# Altium project control.PrjPCB
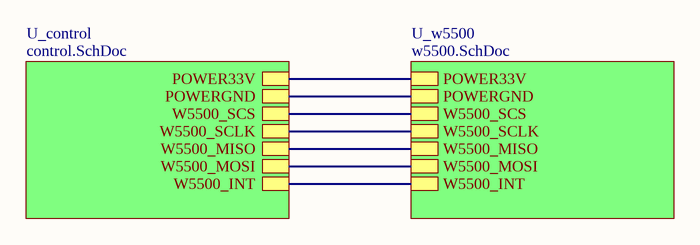
[diagram p0: main.SchDoc]
3 sheets, 91 parts. Net scope: hierarchical (ports join the sheet entries above them; power ports are global).
Board file: control.PcbDoc
Sheets:
  main.SchDoc
    U_control = control.SchDoc
    U_w5500 = w5500.SchDoc

## Sheet main.SchDoc
size A4

### Sub-sheets
U_control = control.SchDoc: POWER33V, POWERGND, W5500_INT, W5500_SCS, W5500_SCLK, W5500_MISO, W5500_MOSI
U_w5500 = w5500.SchDoc: POWERGND, POWER33V, W5500_SCS, W5500_SCLK, W5500_MISO, W5500_MOSI, W5500_INT

### Nets
GND: sheet U_control/POWERGND, sheet U_w5500/POWERGND
VCC33V: sheet U_control/POWER33V, sheet U_w5500/POWER33V
INT: sheet U_control/W5500_INT, sheet U_w5500/W5500_INT
MISO: sheet U_control/W5500_MISO, sheet U_w5500/W5500_MISO
MOSI: sheet U_control/W5500_MOSI, sheet U_w5500/W5500_MOSI
SCLK: sheet U_control/W5500_SCLK, sheet U_w5500/W5500_SCLK
SCS: sheet U_control/W5500_SCS, sheet U_w5500/W5500_SCS

## Sheet control.SchDoc
size A4
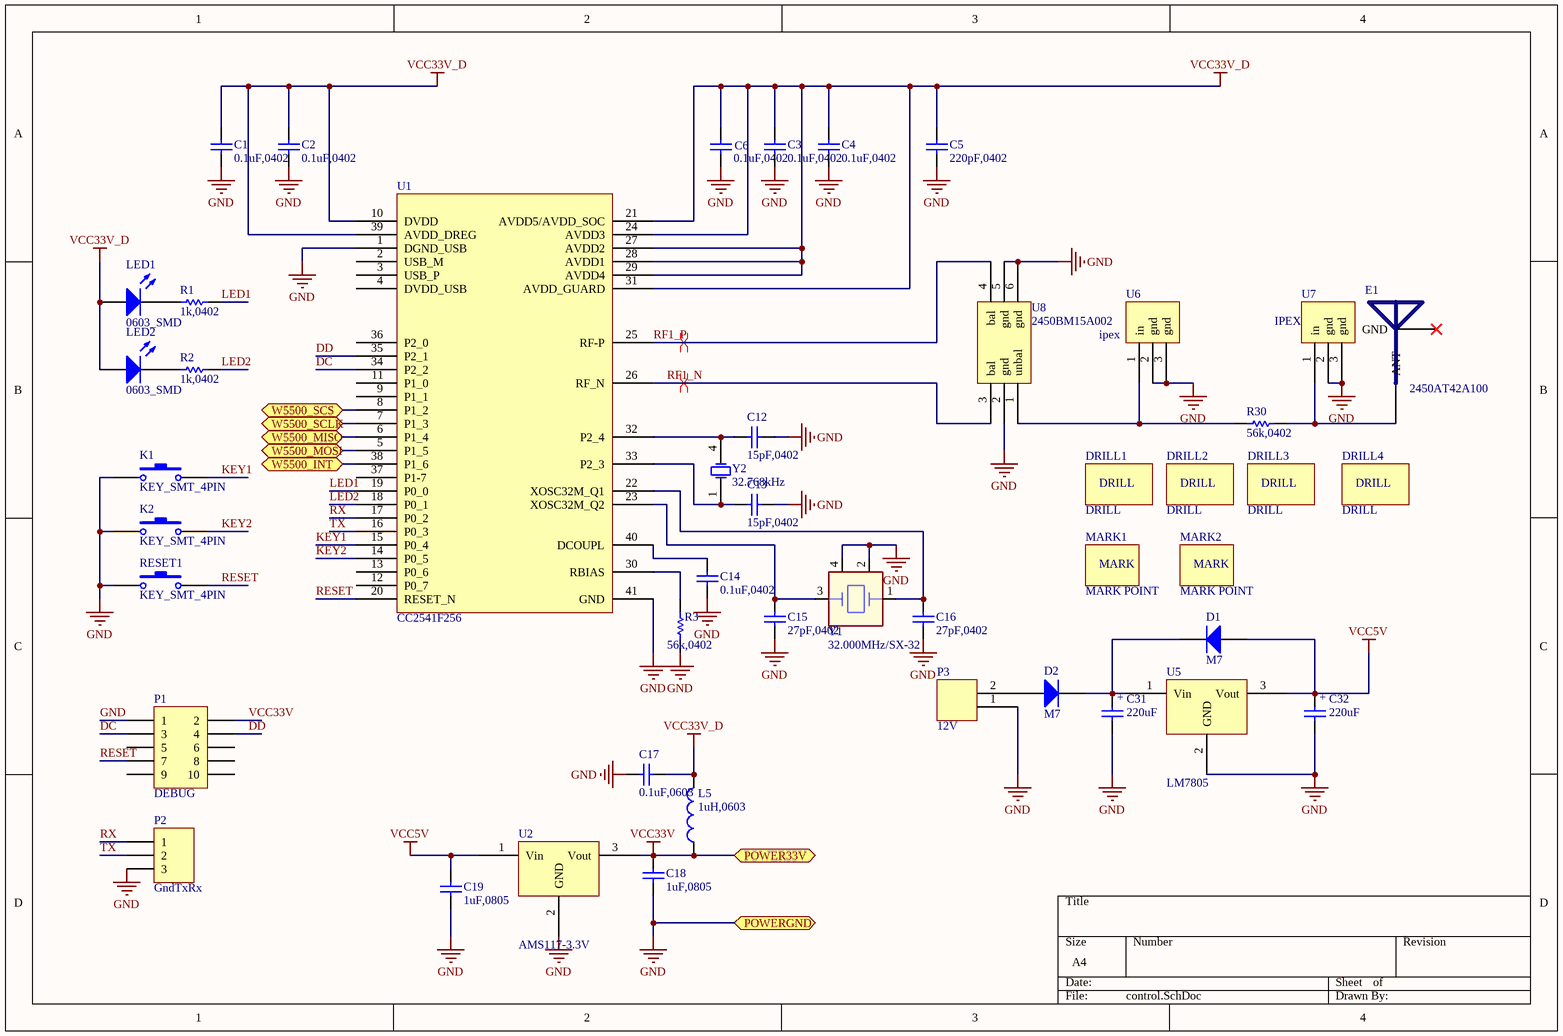
[diagram p1: control.SchDoc]

### Parts
C1  0.1uF,0402  [C0402]
C2  0.1uF,0402  [C0402]
C3  0.1uF,0402  [C0402]
C4  0.1uF,0402  [C0402]
C5  220pF,0402  [C0402]
C6  0.1uF,0402  [C0402]
C12  15pF,0402  [C0402]
C13  15pF,0402  [C0402]
C14  0.1uF,0402  [C0402]
C15  27pF,0402  [C0402]
C16  27pF,0402  [C0402]
C17  0.1uF,0603  [C0603]
C18  1uF,0805  [C0805]
C19  1uF,0805  [C0805]
C31  220uF  [CDIP2]
C32  220uF  [CDIP2]
D1  M7  [DO214AC]
D2  M7  [DO214AC]
DRILL1  DRILL  [DRILL_3MM]
DRILL2  DRILL  [DRILL_3MM]
DRILL3  DRILL  [DRILL_3MM]
DRILL4  DRILL  [DRILL_3MM]
E1  2450AT42A100  [BT_ANT_PCB]
K1  KEY_SMT_4PIN  [KEY-SMT]
K2  KEY_SMT_4PIN  [KEY-SMT]
L5  1uH,0603  [L0603]
LED1  0603_SMD  [LED0603]
LED2  0603_SMD  [LED0603]
MARK1  MARK POINT  [MARK_POINT]
MARK2  MARK POINT  [MARK_POINT]
P1  DEBUG  [HDR2X5]
P2  GndTxRx  [HDR1X3]
P3  12V  [2EDG-5.08-2P]
R1  1k,0402  [R0402]
R2  1k,0402  [R0402]
R3  56k,0402  [R0402]
R30  56k,0402  [R0805]
RESET1  KEY_SMT_4PIN  [KEY-SMT]
U1  CC2541F256  [PQFP40]
U2  AMS117-3.3V  [SOT223]
U5  LM7805  [SOT252]
U6  ipex  [IPEX]
U7  IPEX  [IPEX]
U8  2450BM15A002  [2450BM15A002]
Y1  32.000MHz/SX-32  [3225]
Y2  32.768kHz  [1206]

### Ports
POWER33V, POWERGND, W5500_INT, W5500_MISO, W5500_MOSI, W5500_SCLK, W5500_SCS

### Nets
GND: C1.1 C2.1 C3.1 C4.1 C5.1 C6.2 C12.1 C13.1 C14.1 C15.1 C16.1 C17.2 C18.1 C19.1 C31.2 C32.2 K1.1 K2.1 P1.1 P2.3 P3.1 R3.1 RESET1.1 U1.1(DGND_USB) U1.41(GND) U2.2(GND) U5.2(GND) U6.2(gnd) U6.3(gnd) U7.2(gnd) U7.3(gnd) U8.2(gnd) U8.5(gnd) U8.6(gnd) Y1.2 Y1.4 ; port POWERGND
VCC5V: C19.2 C32.1 D1.1(A) U2.1(Vin) U5.3(Vout)
VCC33V: C18.2 L5.1 P1.2 U2.3(Vout) ; port POWER33V
VCC33V_D: C1.2 C2.2 C3.2 C4.2 C5.2 C6.1 C17.1 L5.2 LED1.1(A) LED2.1(A) U1.10(DVDD) U1.21(AVDD5/AVDD_SOC) U1.24(AVDD3) U1.27(AVDD2) U1.28(AVDD1) U1.29(AVDD4) U1.31(AVDD_GUARD) U1.39(AVDD_DREG)
DC: P1.3 U1.34(P2_2)
DD: P1.4 U1.35(P2_1)
INT: U1.38(P1_6) ; port W5500_INT
KEY1: K1.2 U1.15(P0_4)
KEY2: K2.2 U1.14(P0_5)
LED1: R1.2 U1.19(P0_0)
LED2: R2.2 U1.18(P0_1)
MISO: U1.6(P1_4) ; port W5500_MISO
MOSI: U1.5(P1_5) ; port W5500_MOSI
RESET: P1.7 RESET1.2 U1.20(RESET_N)
RF1_N: U1.26(RF_N) U8.3(bal)
RF1_P: U1.25(RF-P) U8.4(bal)
RX: P2.1 U1.17(P0_2)
SCLK: U1.7(P1_3) ; port W5500_SCLK
SCS: U1.8(P1_2) ; port W5500_SCS
TX: P2.2 U1.16(P0_3)
NetC12_2: C12.2 U1.32(P2_4) Y2.4(OSC2)
NetC13_2: C13.2 U1.33(P2_3) Y2.1(OSC1)
NetC14_2: C14.2 U1.40(DCOUPL)
NetC15_2: C15.2 U1.23(XOSC32M_Q2) Y1.3
NetC16_2: C16.2 U1.22(XOSC32M_Q1) Y1.1
NetC31_1: C31.1 D1.2(K) D2.2(K) U5.1(Vin)
NetD2_1: D2.1(A) P3.2
NetE1_1: E1.1(ANT) R30.2 U7.1(in)
NetLED1_2: LED1.2(K) R1.1
NetLED2_2: LED2.2(K) R2.1
NetR3_2: R3.2 U1.30(RBIAS)
NetR30_1: R30.1 U6.1(in) U8.1(unbal)

Not connected (* = marked no-connect by the designer): E1 2(GND)*; P1 5 6 8 9 10; U1 2(USB_M) 3(USB_P) 4(DVDD_USB) 9(P1_1) 11(P1_0) 12(P0_7) 13(P0_6) 36(P2_0) 37(P1-7)

### Layout directives
differential pair: RF1_N, RF1_P

### Notes on the sheet
- (in symbol E_CAP) +
- (in symbol MARK_POINT) MARK

### Library data of the parts
C1-C6 C12-C19 = CAP: Capacitor; Published: 8-Jun-2000; Revision: July-2002: Re-released for DXP Platform.; Publisher: Altium Limited
  C1-C4 C6 C14 C17: Value: 0.1uF
  C5: Value: 220pF
  C12 C13: Value: 15pF
  C15 C16: Value: 27pF
  C18: value: 1uF
  C19: Value: 1uF
C31 C32 = E_CAP: electric capacitor; value: 220uF
D1 D2 = DIODE: value: M7
E1 = BT_ANT_PCB
K1 K2 RESET1 = KEY
L5 = Inductor: Code_IEC: 1005; Published: 8-Jun-2000; LatestRevisionDate: 17-Jul-2002; LatestRevisionNote: Re-released for DXP Platform.; PackageReference: 0402-A; Publisher: Altium Limited; Code_JEITA: 0402; Value: 1uH
LED1 LED2 = LED
MARK1 MARK2 = MARK_POINT
P1 = Header 5X2: Header, 5-Pin, Dual row; LatestRevisionDate: 17-Jul-2002; LatestRevisionNote: Re-released for DXP Platform.; Publisher: Altium Limited
P2 = Header 3: Header, 3-Pin; LatestRevisionDate: 17-Jul-2002; LatestRevisionNote: Re-released for DXP Platform.; Publisher: Altium Limited
P3 = 2EDG-5.08-2P
R1-R3 = Res1: Resistor; Published: 8-Jun-2000; Revision: July-2002: Re-released for DXP Platform.; Publisher: Altium Limited
  R1 R2: value: 1k
  R3: value: 56k
R30 = Res1: Resistor; value: 10k; Published: 8-Jun-2000; Revision: July-2002: Re-released for DXP Platform.; Publisher: Altium Limited
U1 = CC254x: TI cc2541F256; value: cc2541F256
U2 = VOLT_REG: voltage regulator tube; pin to pad: 1>3 2>1 3>2; value: ams1117-3.3V
U5 = VOLT_REG: voltage regulator tube; value: LM7805
Y1 = CRYSTAL_5: SPXO; value: 32MHz
Y2 = DA740C: crystal; pin to pad: 4>2; value: 32.768kHz

## Sheet w5500.SchDoc
size A4
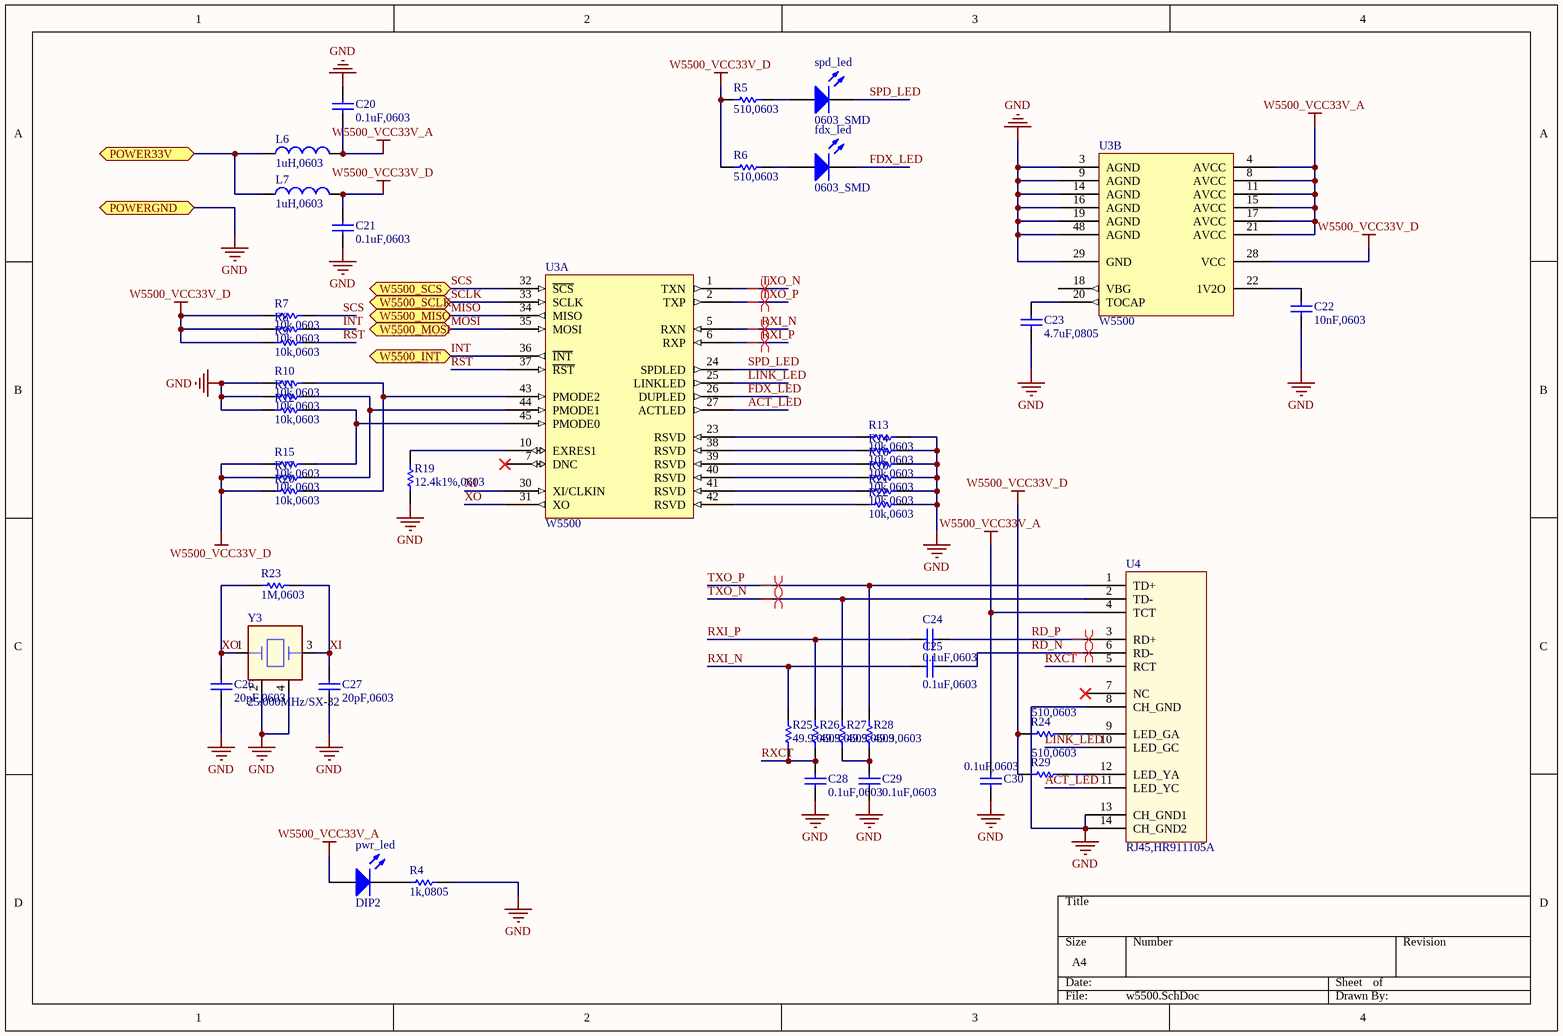
[diagram p2: w5500.SchDoc]

### Parts
C20  0.1uF,0603  [C0603]
C21  0.1uF,0603  [C0603]
C22  10nF,0603  [C0603]
C23  4.7uF,0805  [C0805]
C24  0.1uF,0603  [C0603]
C25  0.1uF,0603  [C0603]
C26  20pF,0603  [C0603]
C27  20pF,0603  [C0603]
C28  0.1uF,0603  [C0603]
C29  0.1uF,0603  [C0603]
C30  0.1uF,0603  [C0603]
fdx_led  0603_SMD  [LED0805]
L6  1uH,0603  [L0603]
L7  1uH,0603  [L0603]
pwr_led  DIP2  [LEDDIP2]
R4  1k,0805  [R0805]
R5  510,0603  [R0603]
R6  510,0603  [R0603]
R7  10k,0603  [R0603]
R8  10k,0603  [R0603]
R9  10k,0603  [R0603]
R10  10k,0603  [R0603]
R11  10k,0603  [R0603]
R12  10k,0603  [R0603]
R13  10k,0603  [R0603]
R14  10k,0603  [R0603]
R15  10k,0603  [R0603]
R16  10k,0603  [R0603]
R17  10k,0603  [R0603]
R18  10k,0603  [R0603]
R19  12.4k1%,0603  [R0603]
R20  10k,0603  [R0603]
R21  10k,0603  [R0603]
R22  10k,0603  [R0603]
R23  1M,0603  [R0603]
R24  510,0603  [R0603]
R25  49.9,0603  [R0603]
R26  49.9,0603  [R0603]
R27  49.9,0603  [R0603]
R28  49.9,0603  [R0603]
R29  510,0603  [R0603]
spd_led  0603_SMD  [LED0805]
U3  W5500  [LQFP48]  (parts A,B of 2)
U4  RJ45,HR911105A  [RJ45]
Y3  25.000MHz/SX-32  [3225]

### Ports
POWER33V, POWERGND, W5500_INT, W5500_MISO, W5500_MOSI, W5500_SCLK, W5500_SCS

### Nets
GND: C20.2 C21.1 C22.1 C23.1 C26.2 C27.2 C28.1 C29.2 C30.1 R4.2 R10.1 R11.1 R12.1 R13.2 R14.2 R16.2 R18.2 R19.1 R21.2 R22.2 U3.3(AGND) U3.9(AGND) U3.14(AGND) U3.16(AGND) U3.19(AGND) U3.29(GND) U3.48(AGND) U4.8(CH_GND) U4.13(CH_GND1) U4.14(CH_GND2) Y3.2 Y3.4 ; port POWERGND
VCC33V: L6.1 L7.1 ; port POWER33V
W5500_VCC33V_A: C20.1 C30.2 L6.2 pwr_led.1(A) U3.4(AVCC) U3.8(AVCC) U3.11(AVCC) U3.15(AVCC) U3.17(AVCC) U3.21(AVCC) U4.4(TCT)
W5500_VCC33V_D: C21.2 L7.2 R5.1 R6.1 R7.1 R8.1 R9.1 R15.1 R17.1 R20.1 R24.1 R29.1 U3.28(VCC)
ACT_LED: U3.27(ACTLED) U4.11(LED_YC)
FDX_LED: fdx_led.2(K) U3.26(DUPLED)
INT: R8.2 U3.36(~{INT}) ; port W5500_INT
LINK_LED: U3.25(LINKLED) U4.10(LED_GC)
MISO: U3.34(MISO) ; port W5500_MISO
MOSI: U3.35(MOSI) ; port W5500_MOSI
RD_N: C25.2 U4.6(RD-)
RD_P: C24.2 U4.3(RD+)
RST: R9.2 U3.37(~{RST})
RXCT: C28.2 R25.1 R26.2 U4.5(RCT)
RXI_N: C25.1 R25.2 U3.5(RXN)
RXI_P: C24.1 R26.1 U3.6(RXP)
SCLK: U3.33(SCLK) ; port W5500_SCLK
SCS: R7.2 U3.32(~{SCS}) ; port W5500_SCS
SPD_LED: spd_led.2(K) U3.24(SPDLED)
TXO_N: R27.1 U3.1(TXN) U4.2(TD-)
TXO_P: R28.1 U3.2(TXP) U4.1(TD+)
XI: C27.1 R23.2 U3.30(XI/CLKIN) Y3.3
XO: C26.1 R23.1 U3.31(XO) Y3.1
NetC22_2: C22.2 U3.22(1V2O)
NetC23_2: C23.2 U3.20(TOCAP)
NetC29_1: C29.1 R27.2 R28.2
Netfdx_led_1: fdx_led.1(A) R6.2
Netpwr_led_2: pwr_led.2(K) R4.1
NetR5_2: R5.2 spd_led.1(A)
NetR10_2: R10.2 R20.2 U3.43(PMODE2)
NetR11_2: R11.2 R17.2 U3.44(PMODE1)
NetR12_2: R12.2 R15.2 U3.45(PMODE0)
NetR13_1: R13.1 U3.23(RSVD)
NetR14_1: R14.1 U3.38(RSVD)
NetR16_1: R16.1 U3.39(RSVD)
NetR18_1: R18.1 U3.40(RSVD)
NetR19_2: R19.2 U3.10(EXRES1)
NetR21_1: R21.1 U3.41(RSVD)
NetR22_1: R22.1 U3.42(RSVD)
NetR24_2: R24.2 U4.9(LED_GA)
NetR29_2: R29.2 U4.12(LED_YA)

Not connected (* = marked no-connect by the designer): U3 7(DNC)* 18(VBG); U4 7(NC)*

### Layout directives
differential pair: RD_N, RD_P, RXI_N, RXI_P, TXO_N, TXO_P

### Library data of the parts
C20-C30 = CAP: Capacitor; Published: 8-Jun-2000; Revision: July-2002: Re-released for DXP Platform.; Publisher: Altium Limited
  C20 C21 C24 C25 C28-C30: Value: 0.1uF
  C22: Value: 10nF
  C23: Value: 4.7uF
  C26 C27: Value: 20pF
fdx_led pwr_led spd_led = LED
L6 L7 = Inductor: Code_IEC: 1005; Published: 8-Jun-2000; LatestRevisionDate: 17-Jul-2002; LatestRevisionNote: Re-released for DXP Platform.; PackageReference: 0402-A; Publisher: Altium Limited; Code_JEITA: 0402; Value: 1uH
R4 R7-R18 R20-R23 = Res1: Resistor; Published: 8-Jun-2000; Revision: July-2002: Re-released for DXP Platform.; Publisher: Altium Limited
  R4: value: 1k
  R7-R18 R20-R22: value: 10k
  R23: value: 1M
R5 R6 R24 R29 = Res1: Resistor; value: 510; Published: 8-Jun-2000; Revision: July-2002: Re-released for DXP Platform.; Publisher: Altium Limited
R19 = Res1: Resistor; value: 12.4k; Published: 8-Jun-2000; Revision: July-2002: Re-released for DXP Platform.; Publisher: Altium Limited
R25-R28 = Res1: Resistor; value: 49.9; Published: 8-Jun-2000; Revision: July-2002: Re-released for DXP Platform.; Publisher: Altium Limited
U4 = HR911105A: pin to pad: 14>13
Y3 = CRYSTAL_5

## Nets that join several sheets
GND: control (36 pins), w5500 (32 pins)
VCC33V: control (C18.2 L5.1 P1.2 U2.3), w5500 (L6.1 L7.1)
INT: control (U1.38), w5500 (R8.2 U3.36)
MISO: control (U1.6), w5500 (U3.34)
MOSI: control (U1.5), w5500 (U3.35)
SCLK: control (U1.7), w5500 (U3.33)
SCS: control (U1.8), w5500 (R7.2 U3.32)